# EAGLE schematic Prg_CPLD (EAGLE 5.10)

## Sheet 1 of 4
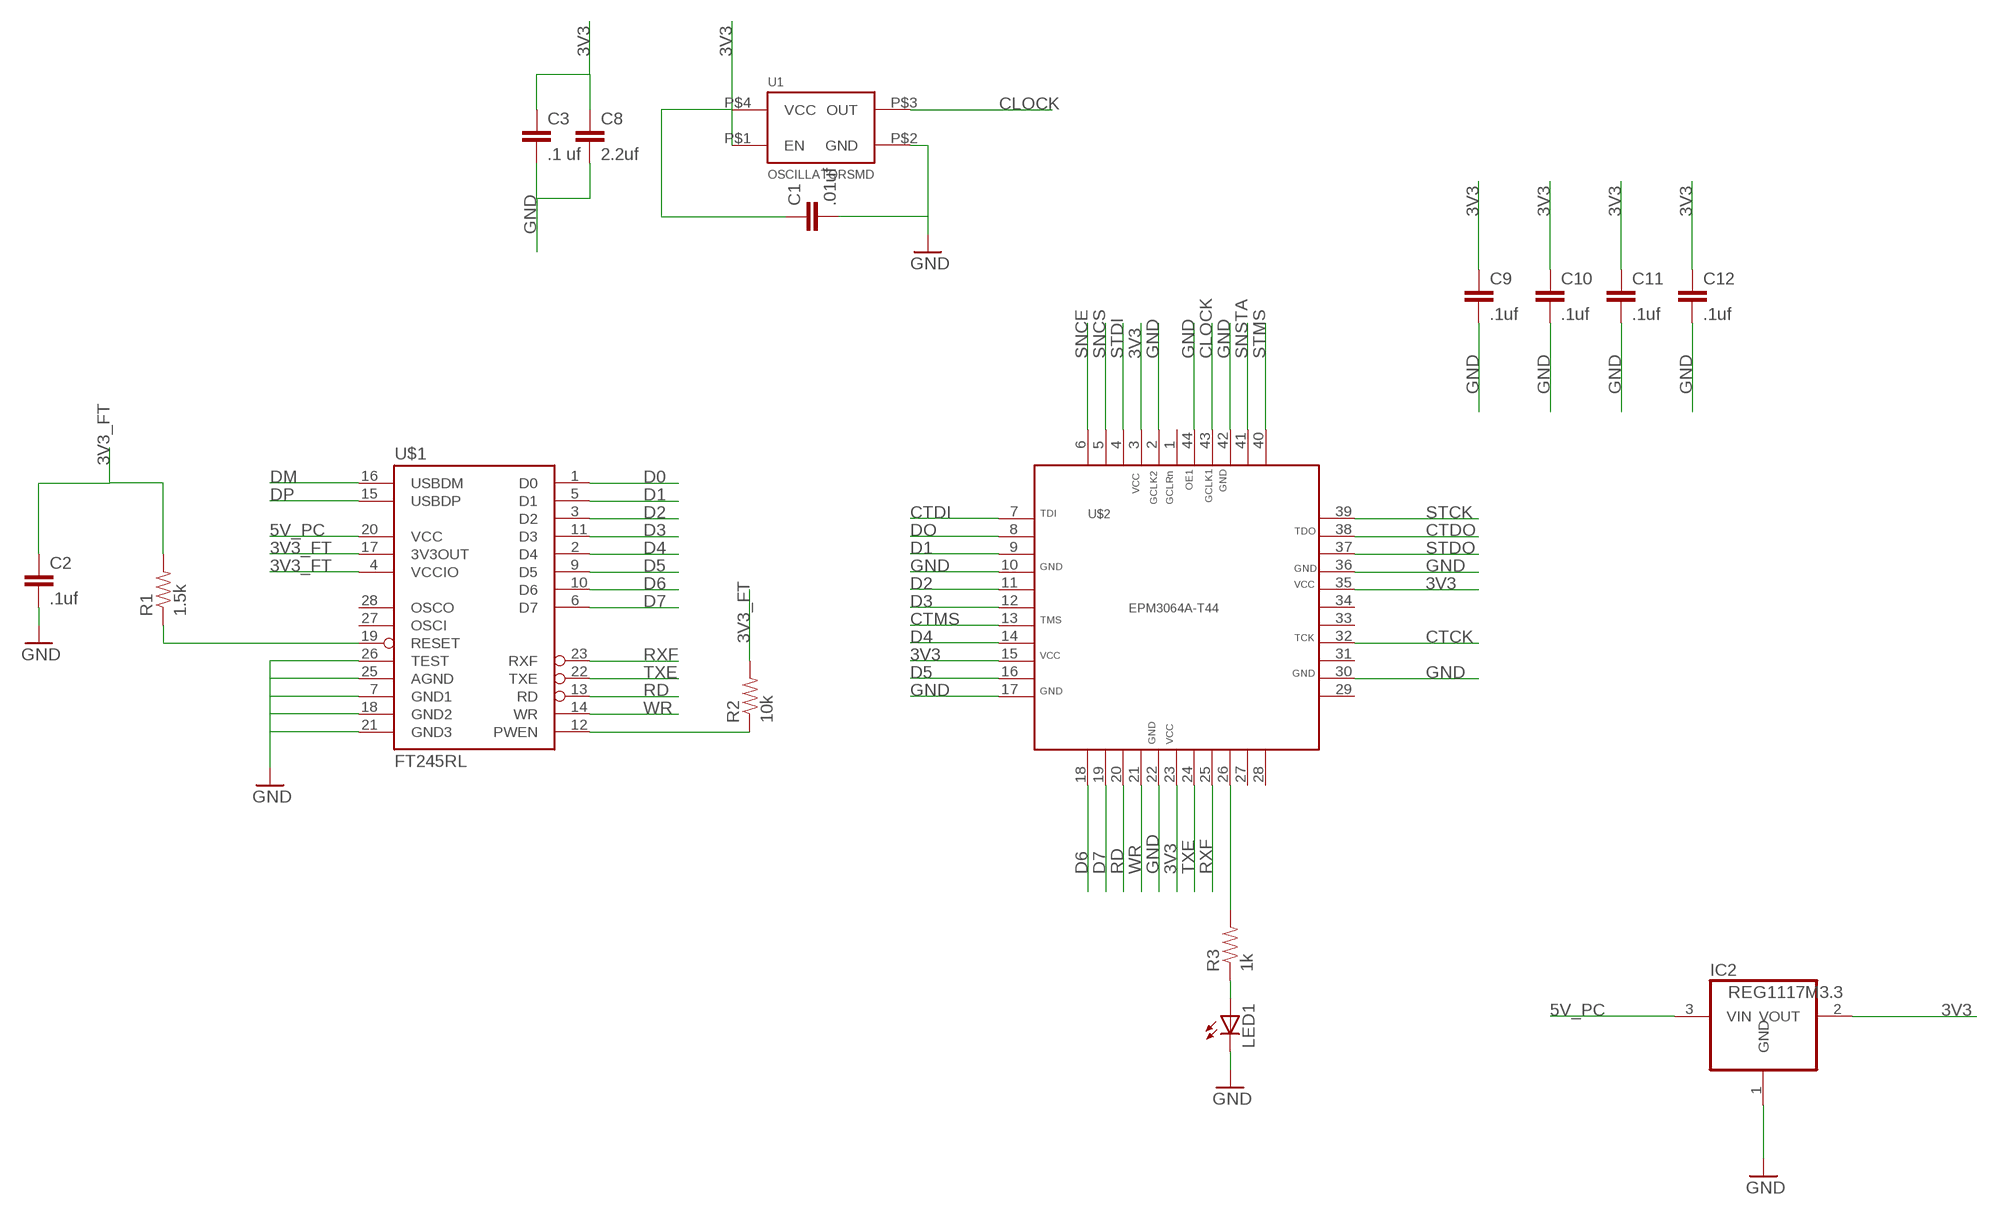
[diagram p0: schematic, sheet 1]

### Parts
C1  .01uf  CAP0805  [0805]
C2  .1uf  CAP0805  [0805]
C3  .1 uf  CAP0805  [0805]
C8  2.2uf  CAP0805  [0805]
C9  .1uf  CAP0805  [0805]
C10  .1uf  CAP0805  [0805]
C11  .1uf  CAP0805  [0805]
C12  .1uf  CAP0805  [0805]
IC2  REG1117M3.3  REG1117  [SOT223]
LED1  LEDCHIPLED_1206  [CHIPLED_1206]
R1  1.5k  RESISTOR  [0805]
R2  10k  RESISTOR  [0805]
R3  1k  RESISTOR  [0805]
U1  OSCILLATORSMD  [CRYSTAL-SMD-7X5]
U$1  FT245RL  [SSOP28DB]
U$2  EPM3064A-T44  [TQFP44]

### Nets
3V3: C1.1 C3.1 C8.1 C9.1 C10.1 C11.1 C12.1 IC2.2(VOUT) U1.P$1(EN) U1.P$4(VCC) U$2.3 U$2.15 U$2.23 U$2.35 ; also sheet 3,4
3V3_FT: C2.1 R1.2 R2.2 U$1.4(VCCIO) U$1.17(3V3OUT)
5V_PC: IC2.3(VIN) U$1.20(VCC) ; also sheet 2
CLOCK: U1.P$3(OUT) U$2.43
CTCK: U$2.32 ; also sheet 3
CTDI: U$2.7 ; also sheet 3
CTDO: U$2.38 ; also sheet 3
CTMS: U$2.13 ; also sheet 3
D0: U$1.1(D0)
D1: U$1.5(D1) U$2.9
D2: U$1.3(D2) U$2.11
D3: U$1.11(D3) U$2.12
D4: U$1.2(D4) U$2.14
D5: U$1.9(D5) U$2.16
D6: U$1.10(D6) U$2.18
D7: U$1.6(D7) U$2.19
DM: U$1.16(USBDM) ; also sheet 2
DO: U$2.8
DP: U$1.15(USBDP) ; also sheet 2
GND: C1.2 C2.2 C3.2 C8.2 C9.2 C10.2 C11.2 C12.2 IC2.1(GND) LED1.C U1.P$2(GND) U$1.7(GND1) U$1.18(GND2) U$1.21(GND3) U$1.25(AGND) U$1.26(TEST) U$2.2 U$2.10 U$2.17 U$2.22 U$2.30 U$2.36 U$2.42 U$2.44 ; also sheet 2,3,4
N$3: LED1.A R3.1
N$4: R1.1 U$1.19(RESET)
N$8: R2.1 U$1.12(PWEN)
N$13: R3.2 U$2.26
RD: U$1.13(RD) U$2.20
RXF: U$1.23(RXF) U$2.25
SNCE: U$2.6 ; also sheet 4
SNCS: U$2.5 ; also sheet 4
SNSTA: U$2.41 ; also sheet 4
STCK: U$2.39 ; also sheet 4
STDI: U$2.4 ; also sheet 4
STDO: U$2.37 ; also sheet 4
STMS: U$2.40 ; also sheet 4
TXE: U$1.22(TXE) U$2.24
WR: U$1.14(WR) U$2.21
Unconnected: U$1.27(OSCI) U$1.28(OSCO) U$2.1 U$2.27 U$2.28 U$2.29 U$2.31 U$2.33 U$2.34

## Sheet 2 of 4
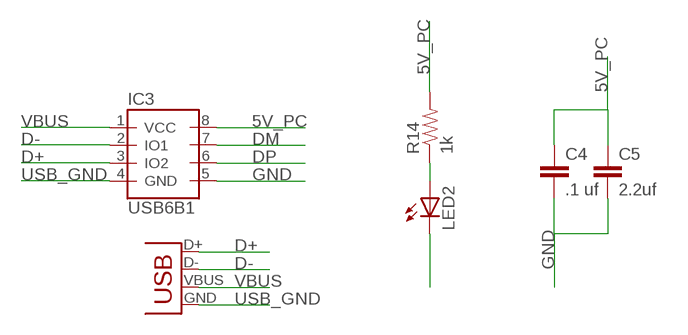
[diagram p1: schematic, sheet 2]

### Parts
C4  .1 uf  CAP0805  [0805]
C5  2.2uf  CAP0805  [0805]
IC3  USB6B1  [SO08]
LED2  LEDCHIPLED_1206  [CHIPLED_1206]
R14  1k  RESISTOR  [0805]
USB1  USB-SMD-NS  [USB-MINIB-NOSTOP]

### Nets
5V_PC: C4.1 C5.1 IC3.8(VCC) R14.2 ; also sheet 1
D+: IC3.3(IO2) USB1.D+
D-: IC3.2(IO1) USB1.D-
DM: IC3.7(IO1) ; also sheet 1
DP: IC3.6(IO2) ; also sheet 1
GND: C4.2 C5.2 IC3.5(GND) LED2.C ; also sheet 1,3,4
N$2: LED2.A R14.1
USB_GND: IC3.4(GND) USB1.GND
VBUS: IC3.1(VCC) USB1.VBUS

## Sheet 3 of 4
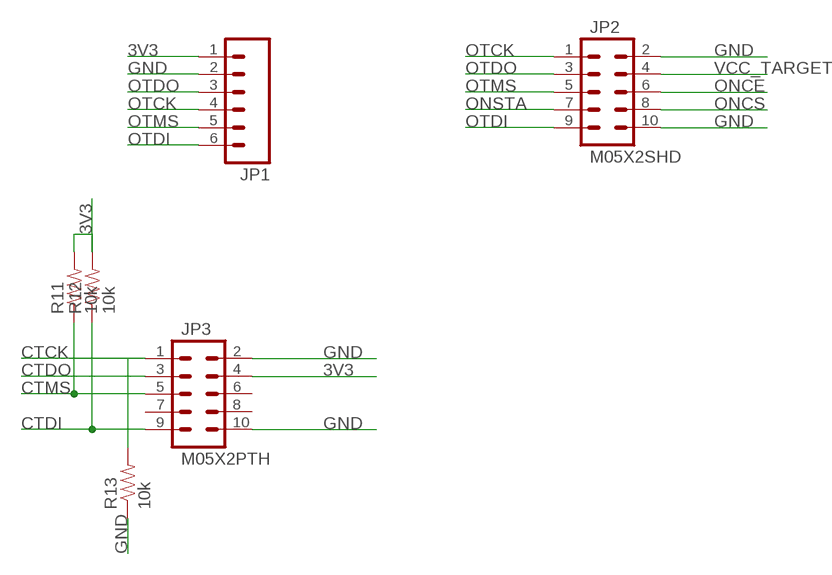
[diagram p2: schematic, sheet 3]

### Parts
JP1  M06SIP  [1X06]
JP2  M05X2SHD  [2X5-SHROUDED]
JP3  M05X2PTH  [AVR_ICSP]
R11  10k  RESISTOR  [0805]
R12  10k  RESISTOR  [0805]
R13  10k  RESISTOR  [0805]

### Nets
3V3: JP1.1 JP3.4 R11.2 R12.2 ; also sheet 1,4
CTCK: JP3.1 R13.2 ; also sheet 1
CTDI: JP3.9 R12.1 ; also sheet 1
CTDO: JP3.3 ; also sheet 1
CTMS: JP3.5 R11.1 ; also sheet 1
GND: JP1.2 JP2.2 JP2.10 JP3.2 JP3.10 R13.1 ; also sheet 1,2,4
ONCE: JP2.6 ; also sheet 4
ONCS: JP2.8 ; also sheet 4
ONSTA: JP2.7 ; also sheet 4
OTCK: JP1.4 JP2.1 ; also sheet 4
OTDI: JP1.6 JP2.9 ; also sheet 4
OTDO: JP1.3 JP2.3 ; also sheet 4
OTMS: JP1.5 JP2.5 ; also sheet 4
VCC_TARGET: JP2.4
Unconnected: JP3.6 JP3.7 JP3.8

## Sheet 4 of 4
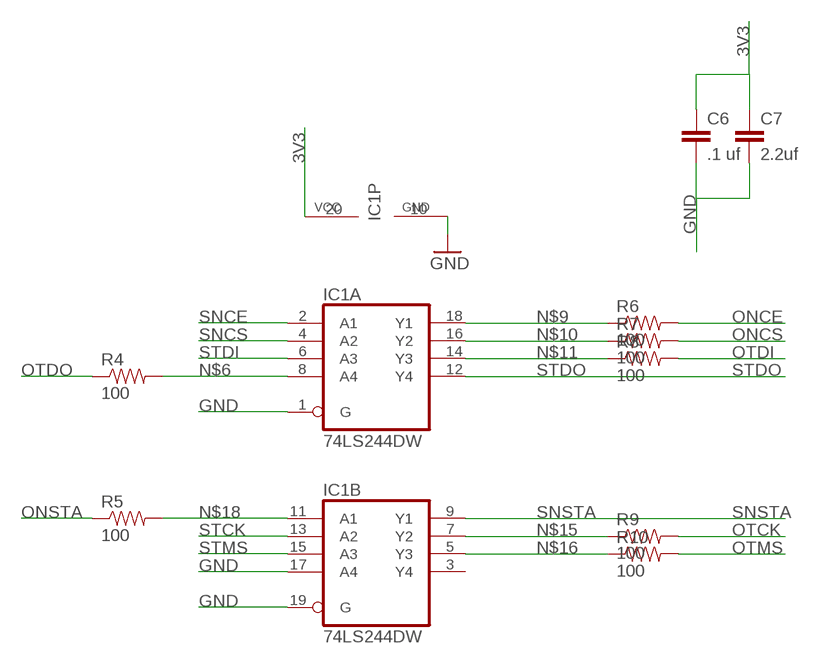
[diagram p3: schematic, sheet 4]

### Parts
C6  .1 uf  CAP0805  [0805]
C7  2.2uf  CAP0805  [0805]
IC1  74LS244DW  [SO20W]
R4  100  RESISTOR  [0805]
R5  100  RESISTOR  [0805]
R6  100  RESISTOR  [0805]
R7  100  RESISTOR  [0805]
R8  100  RESISTOR  [0805]
R9  100  RESISTOR  [0805]
R10  100  RESISTOR  [0805]

### Nets
3V3: C6.1 C7.1 IC1.20(P:VCC) ; also sheet 1,3
GND: C6.2 C7.2 IC1.1(A:G) IC1.10(P:GND) IC1.17(B:A4) IC1.19(B:G) ; also sheet 1,2,3
N$6: IC1.8(A:A4) R4.2
N$9: IC1.18(A:Y1) R6.1
N$10: IC1.16(A:Y2) R7.1
N$11: IC1.14(A:Y3) R8.1
N$15: IC1.7(B:Y2) R9.1
N$16: IC1.5(B:Y3) R10.1
N$18: IC1.11(B:A1) R5.2
ONCE: R6.2 ; also sheet 3
ONCS: R7.2 ; also sheet 3
ONSTA: R5.1 ; also sheet 3
OTCK: R9.2 ; also sheet 3
OTDI: R8.2 ; also sheet 3
OTDO: R4.1 ; also sheet 3
OTMS: R10.2 ; also sheet 3
SNCE: IC1.2(A:A1) ; also sheet 1
SNCS: IC1.4(A:A2) ; also sheet 1
SNSTA: IC1.9(B:Y1) ; also sheet 1
STCK: IC1.13(B:A2) ; also sheet 1
STDI: IC1.6(A:A3) ; also sheet 1
STDO: IC1.12(A:Y4) ; also sheet 1
STMS: IC1.15(B:A3) ; also sheet 1
Unconnected: IC1.3(B:Y4)

## Library data of the parts
C1 C2 = NSL_CylonIV:CAP: Capacitor Standard 0603 ceramic capacitor, and 0.1" leaded capacitor.
C3-C12 = SparkFun:CAP: Capacitor Standard 0603 ceramic capacitor, and 0.1" leaded capacitor.
IC1 = 74xx-us:74*244: Octal BUFFER and LINE DRIVER, 3-state
IC2 = burr-brown:REG1117: 800mA and 1A Low Dropout (LDO) Positive Regulator 1.8V, 2.5V, 2.85V, 3.3V, 5V, and Adj; MPN: REG1117; OC_FARNELL: 1097566; OC_NEWARK: 14P6981
IC3 = st-microelectronics:USB6B1: DATA LINES PROTECTION Source: http://www.st.com/stonline/products/literature/ds/5605.pdf; MPN: USB6B1; OC_FARNELL: 9804358; OC_NEWARK: 26M4750
JP1 = SparkFun:M06: Header 6 Standard 6-pin 0.1" header. Use with straight break away headers (SKU : PRT-00116), right angle break away headers (PRT-00553), swiss pins (PRT-00743), machine pins (PRT-00117), and female headers (PRT-00115). Molex polarized connector foot print use with SKU : PRT-08094 with associated crimp pins and housings. NOTES ON THE VARIANTS LOCK and LOCK_LONGPADS... This footprint was designed to help hold the alignment of a through-hole component (i.e. 6-pin header) while soldering it into place. You may notice that each hole has been shifted either up or down by 0.005 of an inch from it's more standard position (which is a perfectly straight line). This slight alteration caused the pins (the squares in the middle) to touch the edges of the holes. Because they are alternating, it causes a "brace" to hold the component in place. 0.005 has proven to be the perfect amount of "off-center" position when using our standard breakaway headers. Although looks a little odd when you look at the bare footprint, once you have a header in there, the alteration is very hard to notice. Also, if you push a header all the way into place, it is covered up entirely on the bottom side. This idea of altering the position of holes to aid alignment will be further integrated into the Sparkfun Library for other footprints. It can help hold any component with 3 or more connection pins.
JP2 JP3 = SparkFun:M05X2: Header 5x2 Standard 10-pin dual row 0.1" header. Commonly used with AVR-ISP. Use with Spark Fun Electronics SKU: PRT-00778
LED1 LED2 = led:LED: LED OSRAM: - CHIPLED LG R971, LG N971, LY N971, LG Q971, LY Q971, LO R971, LY R971 LH N974, LH R974 LS Q976, LO Q976, LY Q976 LO Q996 - Hyper CHIPLED LW Q18S LB Q993, LB Q99A, LB R99A - SideLED LS A670, LO A670, LY A670, LG A670, LP A670 LB A673, LV A673, LT A673, LW A673 LH A674 LY A675 LS A676, LA A676, LO A676, LY A676, LW A676 LS A679, LY A679, LG A679 - Hyper Micro SIDELED® LS Y876, LA Y876, LO Y876, LY Y876 LT Y87S - SmartLED LW L88C, LW L88S LB L89C, LB L89S, LG L890 LS L89K, LO L89K, LY L89K LS L896, LA L896, LO L896, LY L896 - TOPLED LS T670, LO T670, LY T670, LG T670, LP T670 LSG T670, LSP T670, LSY T670, LOP T670, LYG T670 LG T671, LOG T671, LSG T671 LB T673, LV T673, LT T673, LW T673 LH T674 LS T676, LA T676, LO T676, LY T676, LB T676, LH T676, LSB T676, LW T676 LB T67C, LV T67C, LT T67C, LS T67K, LO T67K, LY T67K, LW E67C LS E67B, LA E67B, LO E67B, LY E67B, LB E67C, LV E67C, LT E67C LW T67C LS T679, LY T679, LG T679 LS T770, LO T770, LY T770, LG T770, LP T770 LB T773, LV T773, LT T773, LW T773 LH T774 LS E675, LA E675, LY E675, LS T675 LS T776, LA T776, LO T776, LY T776, LB T776 LHGB T686 LT T68C, LB T68C - Hyper Mini TOPLED® LB M676 - Mini TOPLED Santana® LG M470 LS M47K, LO M47K, LY M47K Source: http://www.osram.convergy.de LUXEON: - LUMILED® LXK2-PW12-R00, LXK2-PW12-S00, LXK2-PW14-U00, LXK2-PW14-V00 LXK2-PM12-R00, LXK2-PM12-S00, LXK2-PM14-U00 LXK2-PE12-Q00, LXK2-PE12-R00, LXK2-PE12-S00, LXK2-PE14-T00, LXK2-PE14-U00 LXK2-PB12-K00, LXK2-PB12-L00, LXK2-PB12-M00, LXK2-PB14-N00, LXK2-PB14-P00, LXK2-PB14-Q00 LXK2-PR12-L00, LXK2-PR12-M00, LXK2-PR14-Q00, LXK2-PR14-R00 LXK2-PD12-Q00, LXK2-PD12-R00, LXK2-PD12-S00 LXK2-PH12-R00, LXK2-PH12-S00 LXK2-PL12-P00, LXK2-PL12-Q00, LXK2-PL12-R00 Source: www.luxeon.com KINGBRIGHT: KA-3528ASYC Source: www.kingbright.com
R1-R3 = NSL_CylonIV:RESISTOR: Resistor Basic schematic elements and footprints for 0603, 1206, and PTH 1/10th watt (small) resistors.
R4-R14 = TVbNull-Laser:RESISTOR: Resistor Basic schematic elements and footprints for 0603, 1206, and PTH 1/10th watt (small) resistors.
U1 = SparkFun:OSCILLATOR
U$1 = SparkFun:FT245RL: USB FIFO Controller 4th Generation USB Controller (USB <-> Parallel) - FIFO. Spark Fun Electronics SKU : COM-00787
U$2 = Prg_CPLD:EPM3064A-T44
USB1 = SparkFun:USB: USB Connectors USB-B-PTH is fully proven SKU : PRT-00139 USB-miniB is fully proven SKU : PRT-00587 USB-A-PCB is untested. USB-A-H is throughly reviewed, but untested. Spark Fun Electronics SKU : PRT-00437 USB-B-SMT is throughly reviewed, but untested. Needs silkscreen touching up. USB-A-S has not been used/tested USB-MB-H has not been used/tested